# EAGLE design Main_Board_V2.0 (EAGLE 9.6.2)
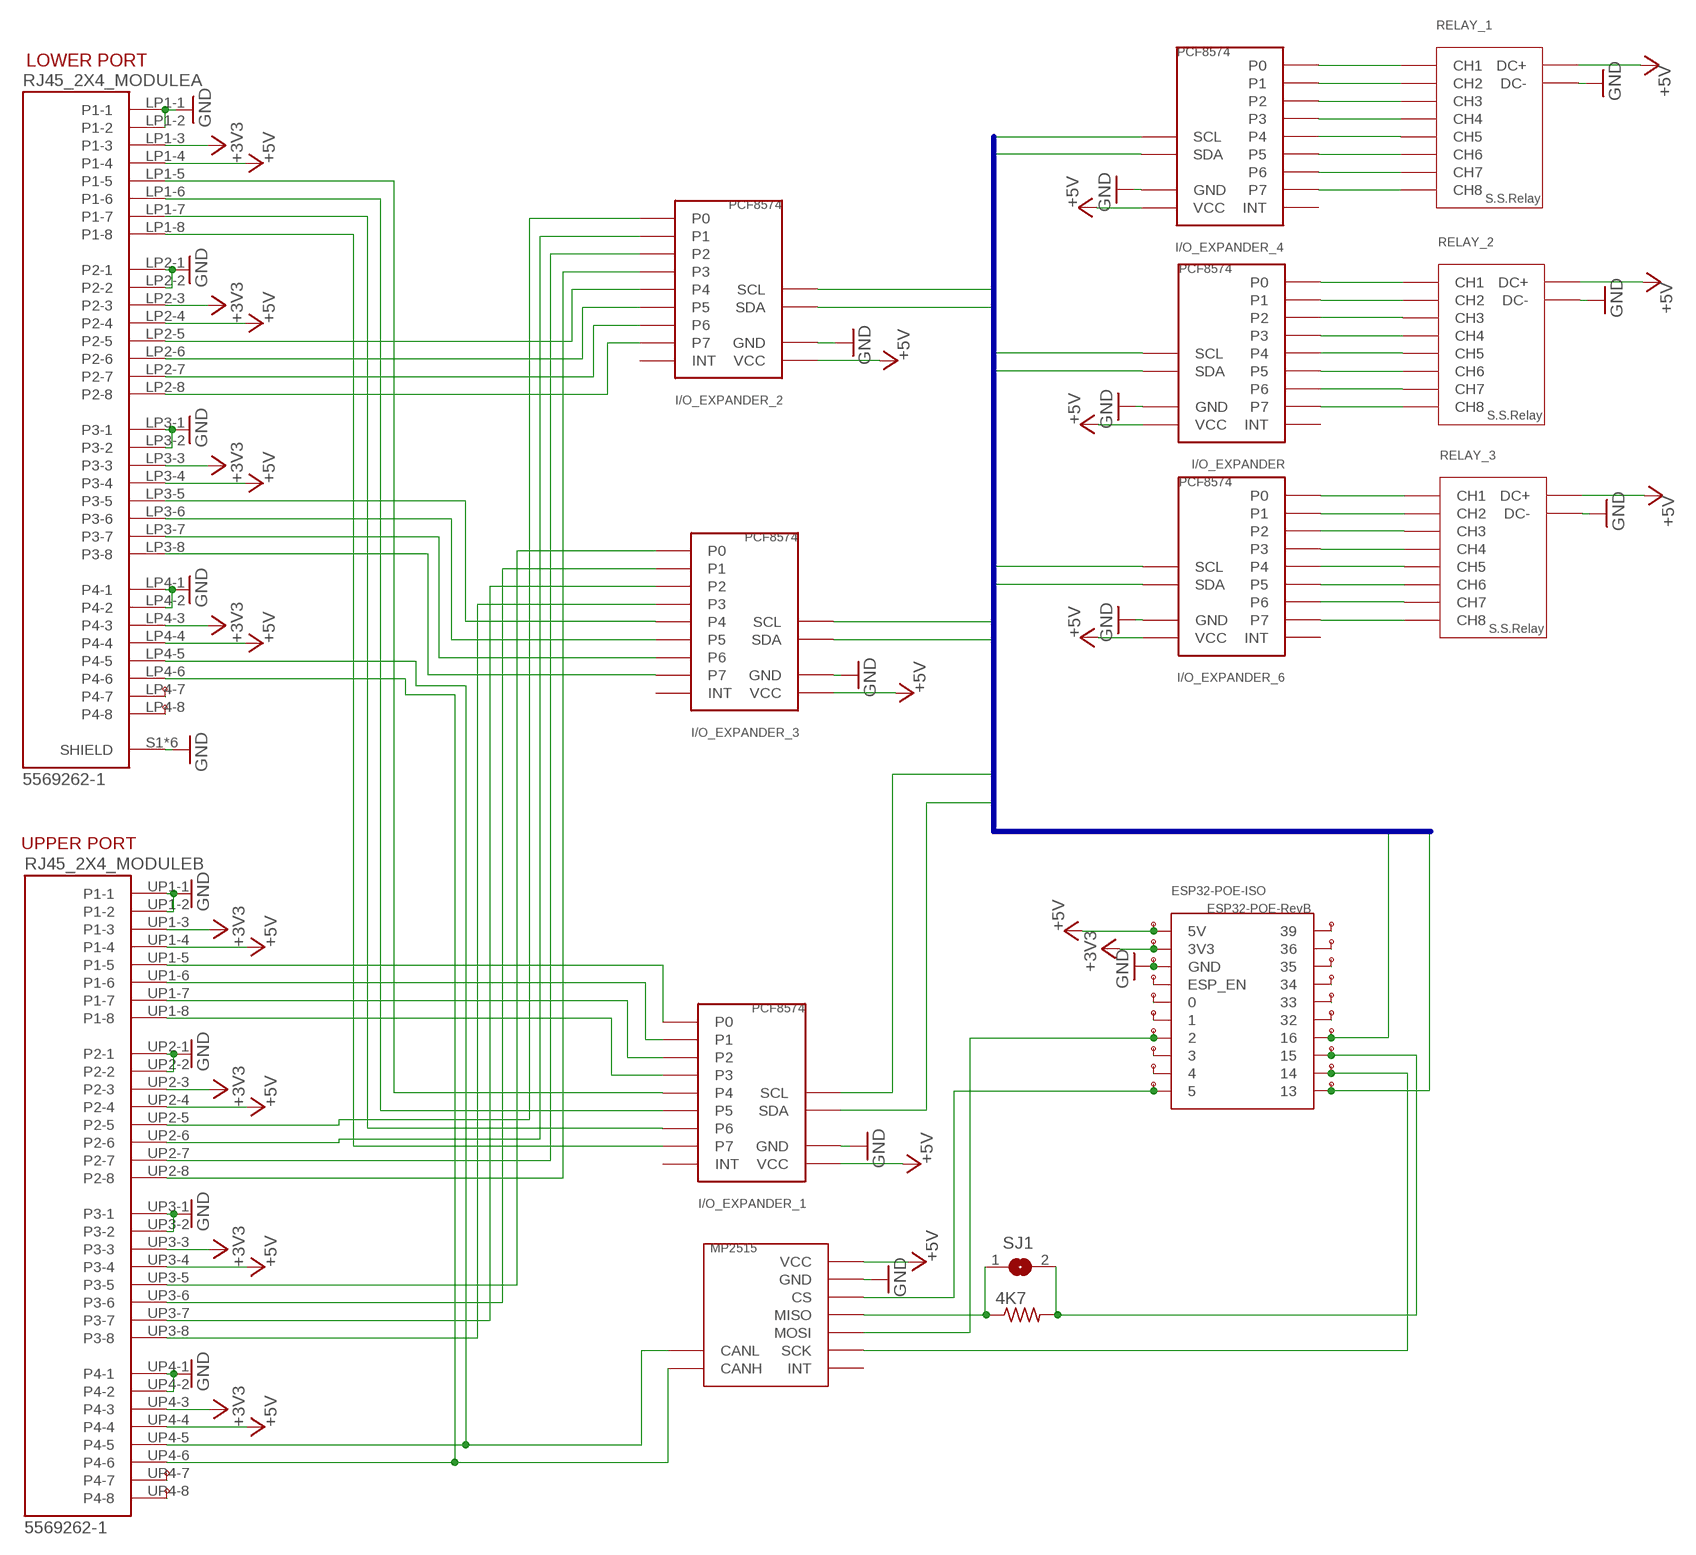
[diagram p0: schematic, sheet 1]

## Parts
4K7  R-US_0207/10  [0207/10]
ESP32-POE-ISO  ESP-POE  [ESP-POE]
I/O_EXPANDER  PCF8574-MODULE_ESPELHADO  [PCF8574-MODULE_ESPELHADO]
I/O_EXPANDER_1  PCF8574-MODULE_ESPELHADO  [PCF8574-MODULE_ESPELHADO]
I/O_EXPANDER_2  PCF8574-MODULE_ESPELHADO  [PCF8574-MODULE_ESPELHADO]
I/O_EXPANDER_3  PCF8574-MODULE_ESPELHADO  [PCF8574-MODULE_ESPELHADO]
I/O_EXPANDER_4  PCF8574-MODULE_ESPELHADO  [PCF8574-MODULE_ESPELHADO]
I/O_EXPANDER_6  PCF8574-MODULE_ESPELHADO  [PCF8574-MODULE_ESPELHADO]
RELAY_1  SSR_M_FULL_SEM_LIGACOES  [SSR_M_SEM_LIGACOES]
RELAY_2  SSR_M_FULL_SEM_LIGACOES  [SSR_M_SEM_LIGACOES]
RELAY_3  SSR_M_FULL_SEM_LIGACOES  [SSR_M_SEM_LIGACOES]
RJ45_2X4_MODULE  5569262-1  [TE_5569262-1]
SJ1  SJ  [SJ]
U$1  TP  [TP]
U$2  TP  [TP]
U$4  TP  [TP]
U$5  TP  [TP]
U$6  TP  [TP]
U$7  TP  [TP]
U$8  TP  [TP]
U$9  TP  [TP]
U$10  TP  [TP]
U$11  TP  [TP]
U$12  TP  [TP]
U$13  TP  [TP]
U$14  TP  [TP]
U$15  TP  [TP]
U$16  TP  [TP]
U$17  TP  [TP]
U$18  TP  [TP]
U$19  TP  [TP]
U$20  TP  [TP]
U$21  TP  [TP]
U$22  TP  [TP]
U$23  TP  [TP]
U$24  TP  [TP]
U$25  TP  [TP]
U$26  MCP2515_MODULE_SEM_LIGACOES  [MCP2515_MODULE_SEM_LIGACOES]

## Nets
+3V3 [+3.3V]: ESP32-POE-ISO.3V3 RJ45_2X4_MODULE.LP1-3(A:P1-3) RJ45_2X4_MODULE.LP2-3(A:P2-3) RJ45_2X4_MODULE.LP3-3(A:P3-3) RJ45_2X4_MODULE.LP4-3(A:P4-3) RJ45_2X4_MODULE.UP1-3(B:P1-3) RJ45_2X4_MODULE.UP2-3(B:P2-3) RJ45_2X4_MODULE.UP3-3(B:P3-3) RJ45_2X4_MODULE.UP4-3(B:P4-3) U$6.P$1
+5V [+5V]: ESP32-POE-ISO.5V I/O_EXPANDER.VCC I/O_EXPANDER_1.VCC I/O_EXPANDER_2.VCC I/O_EXPANDER_3.VCC I/O_EXPANDER_4.VCC I/O_EXPANDER_6.VCC RELAY_1.DC+ RELAY_2.DC+ RELAY_3.DC+ RJ45_2X4_MODULE.LP1-4(A:P1-4) RJ45_2X4_MODULE.LP2-4(A:P2-4) RJ45_2X4_MODULE.LP3-4(A:P3-4) RJ45_2X4_MODULE.LP4-4(A:P4-4) RJ45_2X4_MODULE.UP1-4(B:P1-4) RJ45_2X4_MODULE.UP2-4(B:P2-4) RJ45_2X4_MODULE.UP3-4(B:P3-4) RJ45_2X4_MODULE.UP4-4(B:P4-4) U$2.P$1 U$26.VCC
GND [GND]: ESP32-POE-ISO.GND I/O_EXPANDER.GND I/O_EXPANDER_1.GND I/O_EXPANDER_2.GND I/O_EXPANDER_3.GND I/O_EXPANDER_4.GND I/O_EXPANDER_6.GND RELAY_1.DC- RELAY_2.DC- RELAY_3.DC- RJ45_2X4_MODULE.LP1-1(A:P1-1) RJ45_2X4_MODULE.LP1-2(A:P1-2) RJ45_2X4_MODULE.LP2-1(A:P2-1) RJ45_2X4_MODULE.LP2-2(A:P2-2) RJ45_2X4_MODULE.LP3-1(A:P3-1) RJ45_2X4_MODULE.LP3-2(A:P3-2) RJ45_2X4_MODULE.LP4-1(A:P4-1) RJ45_2X4_MODULE.LP4-2(A:P4-2) RJ45_2X4_MODULE.S1(A:SHIELD) RJ45_2X4_MODULE.S2(A:SHIELD) RJ45_2X4_MODULE.S3(A:SHIELD) RJ45_2X4_MODULE.S4(A:SHIELD) RJ45_2X4_MODULE.S5(A:SHIELD) RJ45_2X4_MODULE.S6(A:SHIELD) RJ45_2X4_MODULE.UP1-1(B:P1-1) RJ45_2X4_MODULE.UP1-2(B:P1-2) RJ45_2X4_MODULE.UP2-1(B:P2-1) RJ45_2X4_MODULE.UP2-2(B:P2-2) RJ45_2X4_MODULE.UP3-1(B:P3-1) RJ45_2X4_MODULE.UP3-2(B:P3-2) RJ45_2X4_MODULE.UP4-1(B:P4-1) RJ45_2X4_MODULE.UP4-2(B:P4-2) U$7.P$1 U$26.GND
N$1: I/O_EXPANDER_1.P0 RJ45_2X4_MODULE.UP1-5(B:P1-5)
N$2: I/O_EXPANDER_1.P1 RJ45_2X4_MODULE.UP1-6(B:P1-6)
N$3: I/O_EXPANDER_1.P2 RJ45_2X4_MODULE.UP1-7(B:P1-7)
N$4: ESP32-POE-ISO.ESP_EN U$8.P$1
N$5: ESP32-POE-ISO.0 U$9.P$1
N$6: ESP32-POE-ISO.1 U$10.P$1
N$7: ESP32-POE-ISO.2 U$11.P$1 U$26.MOSI
N$8: ESP32-POE-ISO.3 U$12.P$1
N$9: ESP32-POE-ISO.4 U$13.P$1
N$10: ESP32-POE-ISO.5 U$14.P$1 U$26.CS
N$11: ESP32-POE-ISO.39 U$15.P$1
N$12: ESP32-POE-ISO.36 U$16.P$1
N$13: ESP32-POE-ISO.35 U$17.P$1
N$14: ESP32-POE-ISO.34 U$18.P$1
N$15: ESP32-POE-ISO.33 U$19.P$1
N$16: ESP32-POE-ISO.32 U$20.P$1
N$17: I/O_EXPANDER_1.P3 RJ45_2X4_MODULE.UP1-8(B:P1-8)
N$18: 4K7.2 ESP32-POE-ISO.15 SJ1.2 U$22.P$1
N$19: ESP32-POE-ISO.14 U$23.P$1 U$26.SCK
N$20: I/O_EXPANDER_2.P0 RJ45_2X4_MODULE.UP2-5(B:P2-5)
N$21: I/O_EXPANDER_4.P0 RELAY_1.CH1
N$22: I/O_EXPANDER_4.P1 RELAY_1.CH2
N$23: I/O_EXPANDER_4.P2 RELAY_1.CH3
N$24: I/O_EXPANDER_4.P3 RELAY_1.CH4
N$25: I/O_EXPANDER_4.P4 RELAY_1.CH5
N$26: I/O_EXPANDER_2.P1 RJ45_2X4_MODULE.UP2-6(B:P2-6)
N$27: I/O_EXPANDER_4.P5 RELAY_1.CH6
N$28: I/O_EXPANDER_4.P6 RELAY_1.CH7
N$29: I/O_EXPANDER_4.P7 RELAY_1.CH8
N$30: I/O_EXPANDER_6.P0 RELAY_3.CH1
N$31: I/O_EXPANDER_6.P1 RELAY_3.CH2
N$32: I/O_EXPANDER_6.P2 RELAY_3.CH3
N$33: I/O_EXPANDER_6.P3 RELAY_3.CH4
N$34: I/O_EXPANDER_6.P4 RELAY_3.CH5
N$35: I/O_EXPANDER_6.P5 RELAY_3.CH6
N$36: I/O_EXPANDER_6.P6 RELAY_3.CH7
N$37: I/O_EXPANDER_6.P7 RELAY_3.CH8
N$38: I/O_EXPANDER.P0 RELAY_2.CH1
N$39: I/O_EXPANDER.P1 RELAY_2.CH2
N$40: I/O_EXPANDER.P2 RELAY_2.CH3
N$41: I/O_EXPANDER.P3 RELAY_2.CH4
N$42: I/O_EXPANDER.P4 RELAY_2.CH5
N$43: I/O_EXPANDER.P5 RELAY_2.CH6
N$44: I/O_EXPANDER.P6 RELAY_2.CH7
N$45: I/O_EXPANDER.P7 RELAY_2.CH8
N$46: I/O_EXPANDER_1.P4 RJ45_2X4_MODULE.LP1-5(A:P1-5)
N$47: I/O_EXPANDER_1.P5 RJ45_2X4_MODULE.LP1-6(A:P1-6)
N$48: I/O_EXPANDER_1.P6 RJ45_2X4_MODULE.LP1-7(A:P1-7)
N$49: I/O_EXPANDER_1.P7 RJ45_2X4_MODULE.LP1-8(A:P1-8)
N$50: I/O_EXPANDER_2.P2 RJ45_2X4_MODULE.UP2-7(B:P2-7)
N$51: I/O_EXPANDER_2.P3 RJ45_2X4_MODULE.UP2-8(B:P2-8)
N$52: I/O_EXPANDER_2.P4 RJ45_2X4_MODULE.LP2-5(A:P2-5)
N$53: I/O_EXPANDER_2.P5 RJ45_2X4_MODULE.LP2-6(A:P2-6)
N$54: I/O_EXPANDER_2.P6 RJ45_2X4_MODULE.LP2-7(A:P2-7)
N$55: I/O_EXPANDER_2.P7 RJ45_2X4_MODULE.LP2-8(A:P2-8)
N$56: 4K7.1 SJ1.1 U$26.MISO
N$57: I/O_EXPANDER_3.P0 RJ45_2X4_MODULE.UP3-5(B:P3-5)
N$58 [SCL]: RJ45_2X4_MODULE.LP4-5(A:P4-5) RJ45_2X4_MODULE.UP4-5(B:P4-5) U$26.CL(CANL)
N$59: I/O_EXPANDER_3.P1 RJ45_2X4_MODULE.UP3-6(B:P3-6)
N$60: I/O_EXPANDER_3.P2 RJ45_2X4_MODULE.UP3-7(B:P3-7)
N$61: I/O_EXPANDER_3.P3 RJ45_2X4_MODULE.UP3-8(B:P3-8)
N$62: I/O_EXPANDER_3.P4 RJ45_2X4_MODULE.LP3-5(A:P3-5)
N$63: I/O_EXPANDER_3.P5 RJ45_2X4_MODULE.LP3-6(A:P3-6)
N$64: I/O_EXPANDER_3.P6 RJ45_2X4_MODULE.LP3-7(A:P3-7)
N$65: I/O_EXPANDER_3.P7 RJ45_2X4_MODULE.LP3-8(A:P3-8)
N$69: RJ45_2X4_MODULE.UP4-7(B:P4-7) U$1.P$1
N$70: RJ45_2X4_MODULE.UP4-8(B:P4-8) U$4.P$1
N$71: RJ45_2X4_MODULE.LP4-7(A:P4-7) U$5.P$1
N$72: RJ45_2X4_MODULE.LP4-8(A:P4-8) U$25.P$1
N$73 [SCL]: RJ45_2X4_MODULE.LP4-6(A:P4-6) RJ45_2X4_MODULE.UP4-6(B:P4-6) U$26.CH(CANH)
SCL: ESP32-POE-ISO.16 I/O_EXPANDER.SCL I/O_EXPANDER_1.SCL I/O_EXPANDER_2.SCL I/O_EXPANDER_3.SCL I/O_EXPANDER_4.SCL I/O_EXPANDER_6.SCL U$21.P$1
SDA: ESP32-POE-ISO.13 I/O_EXPANDER.SDA I/O_EXPANDER_1.SDA I/O_EXPANDER_2.SDA I/O_EXPANDER_3.SDA I/O_EXPANDER_4.SDA I/O_EXPANDER_6.SDA U$24.P$1
Unconnected: I/O_EXPANDER.INT I/O_EXPANDER_1.INT I/O_EXPANDER_2.INT I/O_EXPANDER_3.INT I/O_EXPANDER_4.INT I/O_EXPANDER_6.INT U$26.INT

## Buses
I2C:SCL,SDA

## Library data of the parts
4K7 = rcl:R-US_: RESISTOR, American symbol; SPICEPREFIX: R
ESP32-POE-ISO = ESP-POE-RevB:ESP-POE
I/O_EXPANDER I/O_EXPANDER_1-I/O_EXPANDER_4 I/O_EXPANDER_6 = PCF8574_Module:PCF8574-MODULE_ESPELHADO
RELAY_1-RELAY_3 = Solid-State-Relay_Module:SSR_M_FULL_SEM_LIGACOES
RJ45_2X4_MODULE = RJ45_2x4:5569262-1: Conn RJ-45 F 64 POS 2.54mm Solder RA Thru-Hole 64 Terminal 8 Port Cat 5 Check prices <https://pricing.snapeda.com/parts/5569262-1/TE%20Connectivity/view-part?ref=eda>; AVAILABILITY: Good; CENTERLINE_PITCH: 1.02 mm[.04 in]; COMMENT: 5569262-1; DESCRIPTION: Conn RJ-45 F 64 POS 2.54mm Solder RA Thru-Hole 64 Terminal 8 Port Cat 5 Tray; EU_ROHS_COMPLIANCE: Compliant; MF: TE Connectivity; MP: 5569262-1; NUMBER_OF_POSITIONS: 8; PACKAGE: None; PRICE: None; PURCHASE-URL: https://pricing.snapeda.com/search/part/5569262-1/?ref=eda
SJ1 = jumper:SJ: SMD solder JUMPER
U$1 U$2 U$4-U$25 = edurobotParts:TP
U$26 = MCP2515_Module:MCP2515_MODULE_SEM_LIGACOES

## Net classes
0 default: width 0.15 mm
1 +5V: width 0.305 mm
2 GND: width 0.305 mm
3 +3.3V: width 0.305 mm
4 SCL: width 0.15 mm
5 SDA: width 0.15 mm

## Board
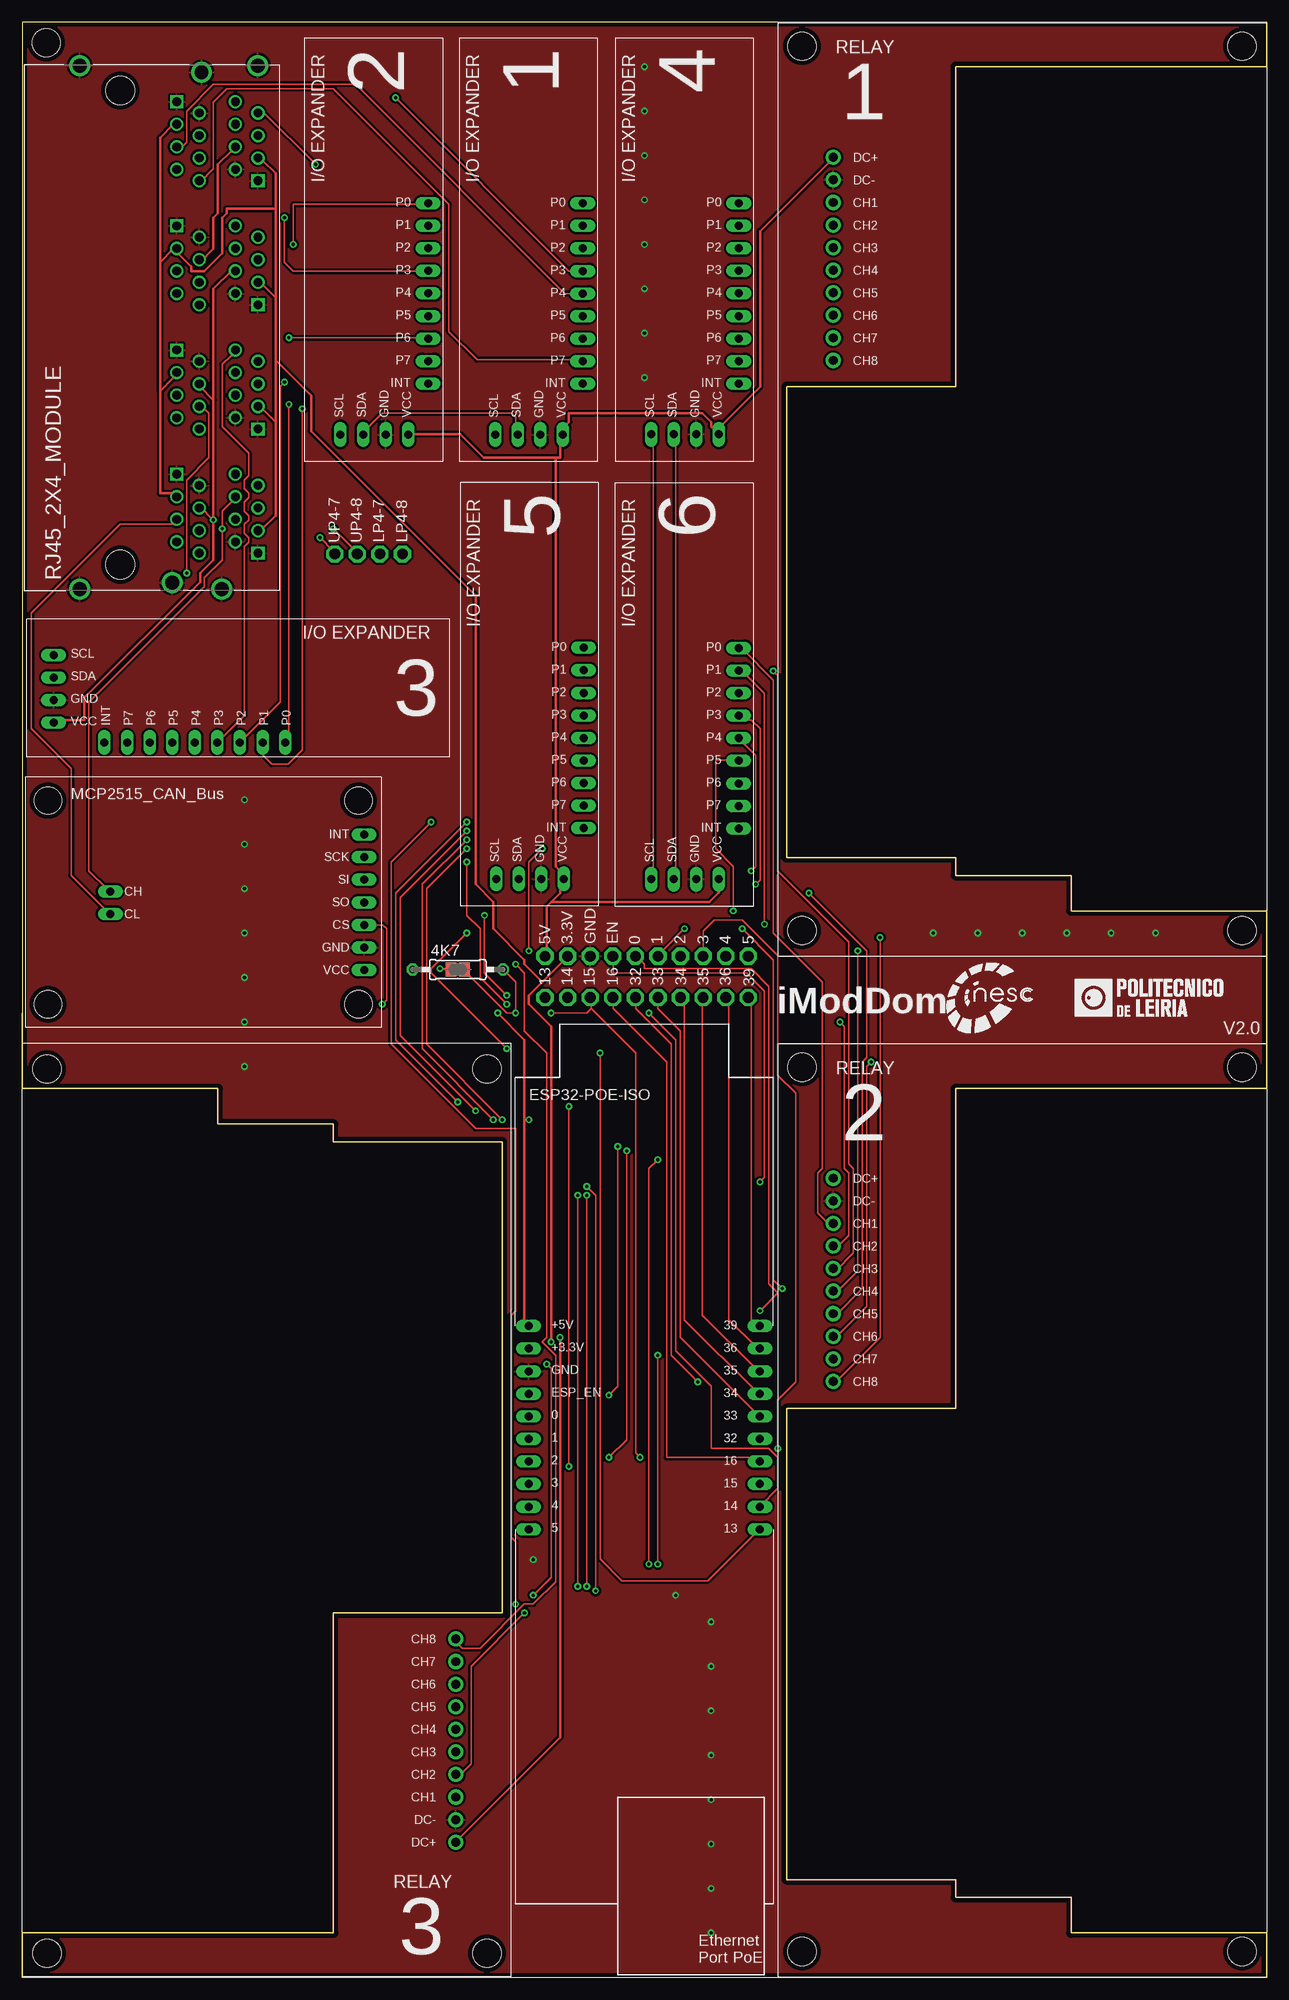
[diagram p1: board, top side]
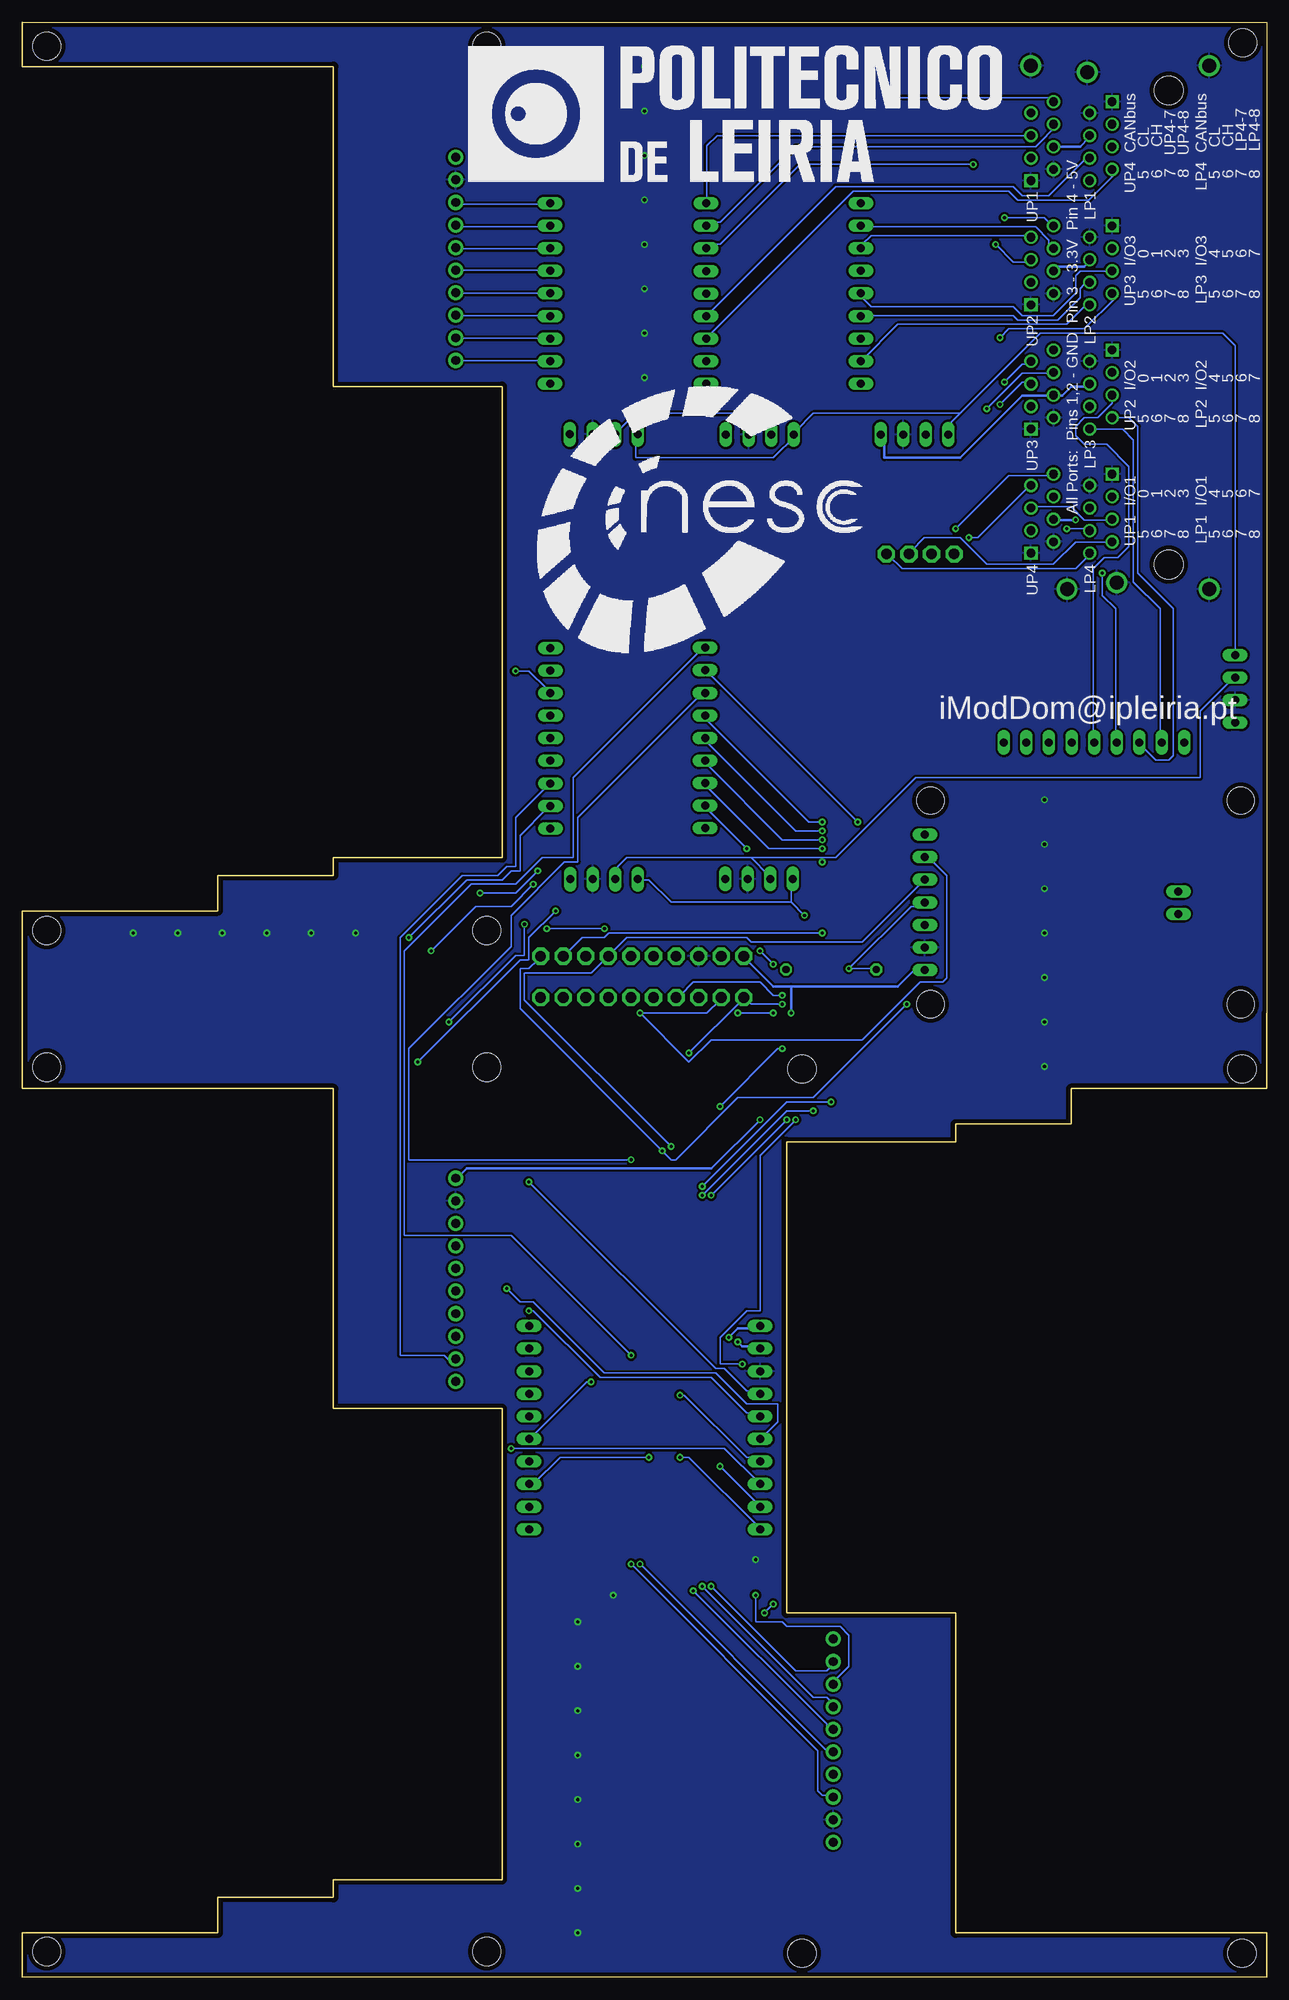
[diagram p2: board, bottom side, seen from below]

Size 140 x 220 mm. Coordinates in mm from the lower left corner, seen from the top.
Outline: 0,0 140,0 140,5 118,5 118,9 105,9 105,11 86,11 86,64 105,64 105,100 140,100 140,120 118,120 118,124 105,124 105,126 86,126 86,179 105,179 105,215 140,215 140,220 0,220 0,108.5 0,100 22,100 22,96 35,96 35,94 54,94 54,41 35,41 35,5 0,5 0,0
Copper layers (1*16): Top 0.035mm / dielectric 1.5mm / Bottom 0.035mm
Design rules "default *": minimum track width 6mil, minimum drill 0.35mm, track to track 0.25mm, track to pad 0.25mm, pad to pad 6mil, via to via 6mil, smd to smd 6mil, copper to edge 0.5mm, drill to drill 6mil, minimum pad ring 10mil, minimum via ring 8mil, stop-mask expansion 4mil, vias tented up to drill 0mil, thermal gap 10mil
Holes 3.2 mm at 2.7,217.7

### Footprints (pad centres in the part's own frame; a part is rotated, then mirrored left to right if it is on the bottom)
0207/10 = drill 0.813 octagon: 1 -5.08,0; 2 5.08,0
ESP-POE = drill 0.9 pad 1.3 long: 0 0,-10.16; 1 0,-12.7; 2 0,-15.24; 3 0,-17.78; 3V3 0,-2.54; 4 0,-20.32; 5 0,-22.86; 5V 0,0; 13 26,-22.86; 14 26,-20.32; 15 26,-17.78; 16 26,-15.24; 32 26,-12.7; 33 26,-10.16; 34 26,-7.62; 35 26,-5.08; 36 26,-2.54; 39 26,0; ESP_EN 0,-7.62; GND 0,-5.08
PCF8574-MODULE_ESPELHADO = drill 0.9 pad 1.3 long: GND 0,-5.08; INT 5.71,-9.85; P0 26.03,-9.85; P1 23.49,-9.85; P2 20.95,-9.85; P3 18.41,-9.85; P4 15.87,-9.85; P5 13.33,-9.85; P6 10.79,-9.85; P7 8.25,-9.85; SCL 0,0; SDA 0,-2.54; VCC 0,-7.62
SSR_M_SEM_LIGACOES = drill 1 pad 1.7: CH1 17.58,3.5; CH2 20.12,3.5; CH3 22.66,3.5; CH4 25.2,3.5; CH5 27.74,3.5; CH6 30.28,3.5; CH7 32.82,3.5; CH8 35.36,3.5; DC+ 12.5,3.5; DC- 15.04,3.5 | hole 3.2: 0,0; 99.5,0; 99.5,49.5; 0,49.5
TE_5569262-1 = drill 0.97 square: LP1-1 0,0; LP2-1 13.97,0; LP3-1 27.94,0; LP4-1 41.91,0; UP1-1 8.89,9.14; UP2-1 22.86,9.14; UP3-1 36.83,9.14; UP4-1 50.8,9.14 | drill 0.97: LP1-2 1.27,2.54; LP1-3 2.54,0; LP1-4 3.81,2.54; LP1-5 5.08,0; LP1-6 6.35,2.54; LP1-7 7.62,0; LP1-8 8.89,2.54; LP2-2 15.24,2.54; LP2-3 16.51,0; LP2-4 17.78,2.54; LP2-5 19.05,0; LP2-6 20.32,2.54; LP2-7 21.59,0; LP2-8 22.86,2.54; LP3-2 29.21,2.54; LP3-3 30.48,0; LP3-4 31.75,2.54; LP3-5 33.02,0; LP3-6 34.29,2.54; LP3-7 35.56,0; LP3-8 36.83,2.54; LP4-2 43.18,2.54; LP4-3 44.45,0; LP4-4 45.72,2.54; LP4-5 46.99,0; LP4-6 48.26,2.54; LP4-7 49.53,0; LP4-8 50.8,2.54; UP1-2 7.62,6.6; UP1-3 6.35,9.14; UP1-4 5.08,6.6; UP1-5 3.81,9.14; UP1-6 2.54,6.6; UP1-7 1.27,9.14; UP1-8 0,6.6; UP2-2 21.59,6.6; UP2-3 20.32,9.14; UP2-4 19.05,6.6; UP2-5 17.78,9.14; UP2-6 16.51,6.6; UP2-7 15.24,9.14; UP2-8 13.97,6.6; UP3-2 35.56,6.6; UP3-3 34.29,9.14; UP3-4 33.02,6.6; UP3-5 31.75,9.14; UP3-6 30.48,6.6; UP3-7 29.21,9.14; UP3-8 27.94,6.6; UP4-2 49.53,6.6; UP4-3 48.26,9.14; UP4-4 46.99,6.6; UP4-5 45.72,9.14; UP4-6 44.45,6.6; UP4-7 43.18,9.14; UP4-8 41.91,6.6 | drill 1.57: S1 -4.06,-10.92; S2 54.87,-10.92; S3 -4.06,9.14; S4 54.11,-0.51; S5 -3.3,2.79; S6 54.87,5.08 | hole 3.25: -1.27,-6.35; 52.08,-6.35
SJ = smd 1.168 x 1.6: 1 -0.762,0; 2 0.762,0
TP = drill 1.2 pad 1.93 octagon: P$1 0,0
MCP2515_MODULE_SEM_LIGACOES = drill 0.9 pad 1.3 long: CH -27.925,12.703; CL -27.925,10.163; CS 0.605,8.923; GND 0.605,6.383; INT 0.605,19.083; MISO 0.605,11.463; MOSI 0.605,14.003; SCK 0.605,16.543; VCC 0.605,3.843 | hole 3.1: -0.035,0.013; -0.035,22.913; -34.935,22.913; -34.935,0.013

### Placement (x,y rotation side)
4K7  49,113.4 0 top
ESP32-POE-ISO  56.98,73.28 0 top
I/O_EXPANDER  53.32,123.59 90 top
I/O_EXPANDER_1  53.21,173.6 90 top
I/O_EXPANDER_2  35.81,173.62 90 top
I/O_EXPANDER_3  3.54,148.8 0 top
I/O_EXPANDER_4  70.76,173.62 90 top
I/O_EXPANDER_6  70.74,123.56 90 top
RELAY_1  87.74,217.3 270 top
RELAY_2  52.28,2.7 90 top
RELAY_3  87.74,102.41 270 top
RJ45_2X4_MODULE  17.38,211.06 270 top
SJ1  49,113.4 0 top
U$1  35.16,160.16 90 top
U$2  58.82,114.9 90 top
U$4  37.7,160.16 0 bottom
U$5  40.24,160.16 0 top
U$6  61.36,114.9 90 bottom
U$7  63.9,114.9 90 top
U$8  66.44,114.9 90 top
U$9  68.98,114.9 90 top
U$10  71.52,114.9 90 top
U$11  74.06,114.9 90 top
U$12  76.6,114.9 90 bottom
U$13  79.14,114.9 90 bottom
U$14  81.68,114.9 90 top
U$15  81.68,110.26 270 bottom
U$16  79.14,110.26 270 top
U$17  76.6,110.26 270 top
U$18  74.06,110.26 270 top
U$19  71.52,110.26 270 top
U$20  68.98,110.26 270 top
U$21  66.44,110.26 270 top
U$22  63.9,110.26 270 top
U$23  61.36,110.26 270 top
U$24  58.82,110.26 270 top
U$25  42.78,160.16 0 top
U$26  37.85,109.5 0 top

### Tracks (layer width: path | path; a pad name or v marks a point on that pad's centre or on a via)
+3V3  (via drill 0.35)
  Top 0.305: v59.5,71.5 59.5,107 57,109.5 57,110.5 58.5,112 | 58.5,112 61,114.5 U$6.P$1 | 28.5,175 28.5,164.5 27,163 RJ45_2X4_MODULE.UP4-3 | 28.5,175 27,176.5 RJ45_2X4_MODULE.UP3-3 | 28.5,189 27,190.5 RJ45_2X4_MODULE.UP2-3 | 28.5,175 28.5,182 | 28.5,182 28.5,189 | 28.5,189 28.5,199 | 28.5,199 28.5,203 27,204.5 RJ45_2X4_MODULE.UP1-3 | 15.5,178.5 15.5,167 17,167 RJ45_2X4_MODULE.LP4-3 | 15.5,178.5 17,180 17,180.5 RJ45_2X4_MODULE.LP3-3 | 15.5,193 17,194.5 RJ45_2X4_MODULE.LP2-3 17.5,194.5 17.5,194 19,192.5 19,192 20.5,192 22.5,194 22.5,198 23,198.5 23,199 28.5,199 | 15.5,178.5 15.5,193 | 15.5,193 15.5,207 17,208.5 RJ45_2X4_MODULE.LP1-3 | 58.5,112 56.5,114 56.5,114.5 53,118 53,121 51,123 51,155.5 32.5,174 32.5,178 28.5,182
  Bottom 0.305: v59.5,71.5 59,71 57,71 ESP32-POE-ISO.3V3
+5V  (via drill 0.35)
  Top 0.305: 60,171 60.5,171 60.5,173.5 I/O_EXPANDER_1.VCC 61,174 61,174.5 61.5,175 61.5,176 76.5,176 77.5,175 77.5,174.5 78,174 I/O_EXPANDER_4.VCC 78.5,174 78.5,174.5 83,179 83,196.5 91,204.5 RELAY_1.DC+ | 60,171 51.91,171 49.28,173.63 43.65,173.63 43.63,173.62 I/O_EXPANDER_2.VCC | v21.5,164 21.5,159.5 20,158 20,157 7,144 7,141.5 4,141.5 I/O_EXPANDER_3.VCC | v21.5,164 20,165.5 RJ45_2X4_MODULE.LP4-4 | 21.5,177.5 20,179 RJ45_2X4_MODULE.LP3-4 | v21.5,164 21.5,177.5 | 21.5,177.5 21.5,190 23.5,192 RJ45_2X4_MODULE.UP2-4 | RJ45_2X4_MODULE.UP1-4 23.5,205.5 22,204 22,198.5 21.5,198 21.5,194.5 20,193 RJ45_2X4_MODULE.LP2-4 | 56.5,96.5 56.5,105.5 v53.5,108.5 | 56.5,96.5 56.5,73.5 ESP32-POE-ISO.5V | 59.5,121 59,120.5 59,115 U$2.P$1 | 59.5,121 60.5,122 60.5,123.5 I/O_EXPANDER.VCC 60.5,124 60.5,124.5 60,125 60,171 | I/O_EXPANDER_6.VCC 78.36,122.09 77.27,121 59.5,121 | v60.5,72 60.5,27 49,15.5 RELAY_2.DC+ | 56.5,96.5 v57,96.5
  Bottom 0.305: RJ45_2X4_MODULE.LP1-4 20,207 21,206 23.5,206 RJ45_2X4_MODULE.UP1-4 | RJ45_2X4_MODULE.LP2-4 20,193 20.5,192.5 23.5,192.5 RJ45_2X4_MODULE.UP2-4 | RJ45_2X4_MODULE.LP3-4 20,179 22,179 23,178 23.5,178 RJ45_2X4_MODULE.UP3-4 24,178 27.5,178 34.5,171 43,171 43,173.5 I/O_EXPANDER_2.VCC | v21.5,164 23.5,164 RJ45_2X4_MODULE.UP4-4 | 53.5,111.5 55.5,111.5 58.5,114.5 U$2.P$1 | 53.5,111.5 41.5,111.5 39.7,113.3 38.46,113.3 38.45,113.32 U$26.VCC | 53.5,111.5 v53.5,108.5 | v60.5,72 59.5,73 57,73 ESP32-POE-ISO.5V | v57,96.5 62.5,91 90,91 91,90 RELAY_3.DC+
GND  (via drill 0.35)
  other vias: 73.5,43 57.5,47 70,180 70,185 70,190 70,195 70,200 70,205 70,210 70,215 25,132.5 25,127.5 25,122.5 25,117.5 25,112.5 25,107.5 25,102.5 102.5,117.5 107.5,117.5 112.5,117.5 117.5,117.5 122.5,117.5 127.5,117.5 77.5,40 77.5,35 77.5,30 77.5,25 77.5,20 77.5,15 77.5,10 77.5,5
  pour Top: -10,230 -10,-10 150,-10 150,230
  pour Bottom: -10,230 150,230 150,-10 -10,-10
N$1
  Bottom 0.152: I/O_EXPANDER_1.P0 63,200 63,206.08 61.83,207.25 RJ45_2X4_MODULE.UP1-5
N$2
  Bottom 0.152: I/O_EXPANDER_1.P1 63,197.5 61.5,197.5 53,206 26,206 23.5,208.5 RJ45_2X4_MODULE.UP1-6
N$3  (via drill 0.35)
  Top 0.152: v33,204 27,210 RJ45_2X4_MODULE.UP1-7
  Bottom 0.152: v33,204 52.5,204 61.5,195 63,195 I/O_EXPANDER_1.P2
N$4  (via drill 0.35)
  Top 0.152: v83,89.5 83.5,90 83.5,111 81.5,113 66.5,113 66.5,114.5 U$8.P$1
  Bottom 0.152: v83,89.5 62,68.5 61,68.5 58.5,66 57,66 ESP32-POE-ISO.ESP_EN
N$5  (via drill 0.35)
  Top 0.152: v83,75 85,77 84,78 84,111.5 82,113.5 70,113.5 70,114 69,115 U$9.P$1
  Bottom 0.152: v83,75 82.5,75 75,67.5 62.5,67.5 58.5,63.5 57,63.5 ESP32-POE-ISO.0
N$6  (via drill 0.35)
  Top 0.152: v85.5,77.5 84.5,78.5 84.5,114.5 v81,118 | v74.5,118 72,115.5 72,115 U$10.P$1
  Bottom 0.152: v85.5,77.5 84,76 82.5,76 74.5,68 62,68 58.5,64.5 55,64.5 55,62.5 56.5,61 ESP32-POE-ISO.1 | v74.5,118 v81,118
N$7  (via drill 0.35)
  Top 0.152: v66,65.5 67,66.5 v67,93.5
  Bottom 0.152: v66,65.5 65.5,65.5 58.5,58.5 57,58.5 ESP32-POE-ISO.2 | v67,93.5 83.5,110 83.5,113 76,113 74.5,114.5 U$11.P$1 74,115 72,117 58.5,117 58,116.5 45.5,116.5 38.5,123.5 U$26.MOSI
N$8  (via drill 0.35)
  Top 0.152: v85,59.5 85,65 87,67 87,99.5 85,101.5 85,115 81,119 77.86,119 76.6,117.74 U$12.P$1
  Bottom 0.152: v85,59.5 61,59.5 57,55.5 ESP32-POE-ISO.3
N$9  (via drill 0.35)
  Top 0.152: v61.5,98 v61.5,57.5 | v54.5,104.5 46,113 46,113.5 v50,117.5
  Bottom 0.152: v61.5,57.5 57,53 ESP32-POE-ISO.4 | v61.5,98 55,104.5 v54.5,104.5 | v50,117.5 74,117.5 74.5,117 77,117 79,115 U$13.P$1
N$10  (via drill 0.35)
  Top 0.152: v66,58.5 68,60.5 v68,93 | v40.5,109.5 41,110 41,118 40.58,118.42 U$26.CS
  Bottom 0.152: v66,58.5 65,58.5 57,50.5 ESP32-POE-ISO.5 | U$14.P$1 82,114.5 83,113.5 84,113.5 84,109 v68,93 67,92 66.5,92 59.5,99 51,99 v40.5,109.5
N$11
  Top 0.152: ESP32-POE-ISO.39 82.5,73.5 82,74 82,110 U$15.P$1
N$12
  Top 0.152: ESP32-POE-ISO.36 82.5,71 79.5,74 79.5,110 U$16.P$1
N$13
  Top 0.152: ESP32-POE-ISO.35 82.5,68.5 76.5,74.5 76.5,110 U$17.P$1
N$14
  Top 0.152: ESP32-POE-ISO.34 82.5,66 74.5,74 74.5,110 U$18.P$1
N$15
  Top 0.152: ESP32-POE-ISO.33 82.5,63.5 74,72 74,106.5 71.5,109 71.5,110 U$19.P$1
N$16  (via drill 0.35)
  Top 0.152: v76,67 73,70 73,105 69,109 69,110 U$20.P$1
  Bottom 0.152: v76,67 76.5,67 82.5,61 ESP32-POE-ISO.32
N$17  (via drill 0.35)
  Top 0.152: I/O_EXPANDER_1.P3 61.49,192.01 v42,211.5
  Bottom 0.152: v42,211.5 24,211.5 RJ45_2X4_MODULE.UP1-8
N$18  (via drill 0.35)
  Top 0.152: SJ1.2 50,113 54.5,108.5 v55.5,108.5 55.5,112 54.5,113 4K7.2 | v69.5,58.5 69,59 69,104 64,109 | 64,109 64,110 U$22.P$1 | v59.5,108.5 63.5,108.5 64,109
  Bottom 0.152: v69.5,58.5 79.5,58.5 82.5,55.5 ESP32-POE-ISO.15 | v59.5,108.5 v55.5,108.5
N$19  (via drill 0.35)
  Top 0.152: v70.5,108.5 73.5,105.5 73.5,70.5 77.5,66.5 77.5,59.5 84,59.5 85,58.5 85,55 83,53 ESP32-POE-ISO.14
  Bottom 0.152: U$23.P$1 61.5,110 63,108.5 v70.5,108.5 65,103 62.5,105.5 45.5,105.5 39,112 36.45,112 36,112.45 36,124 38,126 U$26.SCK
N$20  (via drill 0.35)
  Top 0.152: v30.5,195 30.5,199.5 45.5,199.5 I/O_EXPANDER_2.P0
  Bottom 0.152: v30.5,195 28.5,193 27,193 RJ45_2X4_MODULE.UP2-5
N$21
  Bottom 0.152: I/O_EXPANDER_4.P0 81,199.5 91,199.5 RELAY_1.CH1
N$22
  Bottom 0.152: I/O_EXPANDER_4.P1 81,197 91,197 RELAY_1.CH2
N$23
  Bottom 0.152: I/O_EXPANDER_4.P2 81,194.5 91,194.5 RELAY_1.CH3
N$24
  Bottom 0.152: I/O_EXPANDER_4.P3 80.69,192.11 91.22,192.11 RELAY_1.CH4
N$25
  Bottom 0.152: I/O_EXPANDER_4.P4 91.48,189.48 91.5,189.5 RELAY_1.CH5
N$26
  Bottom 0.152: I/O_EXPANDER_2.P1 45.5,197 26,197 24.5,195.5 24.5,194.5 24,194.5 RJ45_2X4_MODULE.UP2-6
N$27
  Bottom 0.152: I/O_EXPANDER_4.P5 81,187 91,187 RELAY_1.CH6
N$28
  Bottom 0.152: RELAY_1.CH7 91.19,184.43 80.68,184.43 I/O_EXPANDER_4.P6
N$29
  Bottom 0.152: I/O_EXPANDER_4.P7 80.83,181.94 91.25,181.94 RELAY_1.CH8
N$30
  Top 0.152: I/O_EXPANDER_6.P0 81,149.5 84.5,146 84.5,117.5 90,112 90,91 89.5,90.5 89.5,86 91,84.5 RELAY_3.CH1
N$31  (via drill 0.35)
  Top 0.152: v83.5,118.5 83.5,144.5 81,147 I/O_EXPANDER_6.P1 | v92,107.5 92.5,107 92.5,91 93,90.5 93,83.5 91.5,82 RELAY_3.CH2
  Bottom 0.152: v83.5,118.5 83.5,115 84.5,115 v92,107.5
N$32  (via drill 0.35)
  Top 0.152: v84.5,147 85,146.5 85,124.5 93,116.5 93,91.5 93.5,91 93.5,81.5 91.5,79.5 RELAY_3.CH3
  Bottom 0.152: v84.5,147 83,147 81,145 I/O_EXPANDER_6.P2
N$33  (via drill 0.35)
  Top 0.152: v82.5,123 83,123.5 83,140.5 82,141.5 81,141.5 I/O_EXPANDER_6.P3 | v94,115.5 94,79.5 91.5,77 RELAY_3.CH4
  Bottom 0.152: v82.5,123 85,120.5 89,120.5 v94,115.5
N$34  (via drill 0.35)
  Top 0.152: v82,124.5 82.5,125 82.5,137.5 81,139 I/O_EXPANDER_6.P4 | v88.5,122 95,115.5 95,103.5 94.5,103 94.5,77.5 91.5,74.5 RELAY_3.CH5
  Bottom 0.152: v82,124.5 84.5,122 v88.5,122
N$35  (via drill 0.35)
  Top 0.152: v80,120 80,125 78,127 78,137 80.5,137 I/O_EXPANDER_6.P5 | v95.5,103 95,102.5 95,75.5 91.5,72 RELAY_3.CH6
  Bottom 0.152: v80,120 83,117 83,114.5 84,114.5 v95.5,103
N$36
  Bottom 0.152: I/O_EXPANDER_6.P6 81,134 84.5,130.5 84.5,125 85.5,125 86.5,124 90.5,124 97.5,117 97.5,70 92.5,70 92,69.5 91.5,69.5 RELAY_3.CH7
N$37  (via drill 0.35)
  Top 0.152: v96.5,117 96.5,72 91.5,67 RELAY_3.CH8
  Bottom 0.152: v96.5,117 90,123.5 86,123.5 85,124.5 84,124.5 84,128.5 81,131.5 I/O_EXPANDER_6.P7
N$38  (via drill 0.35)
  Top 0.152: v71.5,46.5 v71.5,70
  Bottom 0.152: v71.5,70 85,83.5 97,83.5 97,115.5 89.5,123 84.5,123 81.5,126 78,126 78,135 63.5,149.5 I/O_EXPANDER.P0 | v71.5,46.5 50.5,25.5 50.5,21 50,20.5 49,20.5 RELAY_2.CH1
N$39  (via drill 0.35)
  Top 0.152: v46,130 41.5,125.5 41.5,105 51,95.5 55.5,95.5 55.5,75 55,74.5 55,49.5 55.5,49 v55.5,42 | v56.5,41 50.5,35 50.5,24 49,22.5 RELAY_2.CH2
  Bottom 0.152: v46,130 63,147 I/O_EXPANDER.P1 | v56.5,41 v55.5,42
N$40  (via drill 0.35)
  Top 0.152: v71.5,92 70.5,91 v70.5,46.5
  Bottom 0.152: v71.5,92 96.5,92 96.5,104.5 85,116 85,119.5 79,125.5 77.5,125.5 77.5,130.5 63.5,144.5 I/O_EXPANDER.P2 | v70.5,46.5 49.5,25.5 49,25.5 RELAY_2.CH3
N$41  (via drill 0.35)
  Top 0.152: v50,130 42,122 42,105.5 v49,98.5 | v63.5,89 64.5,88 v64.5,43.5
  Bottom 0.152: v50,130 51.5,130 63,141.5 I/O_EXPANDER.P3 | v49,98.5 54,98.5 v63.5,89 | v64.5,43.5 49.5,28.5 49.5,28 49,28 RELAY_2.CH4
N$42  (via drill 0.35)
  Top 0.152: v50,129 42.5,121.5 42.5,106 v51,97.5 | v63.5,44 v63.5,88
  Bottom 0.152: v50,129 53,129 63,139 I/O_EXPANDER.P4 | v51,97.5 54,97.5 v63.5,88 | v63.5,44 51,31.5 49.5,31.5 48.5,30.5 RELAY_2.CH5
N$43  (via drill 0.35)
  Top 0.152: v50,128 45,123 45,104.5 v53,96.5 | v59,69 59.5,68.5 59.5,45 v57.5,43
  Bottom 0.152: v50,128 54.5,128 63,136.5 I/O_EXPANDER.P5 | v53,96.5 57,92.5 57,75 58.5,75 61.5,72 61.5,69 v59,69 | v57.5,43 57.5,40 54.5,40 54,39.5 48,39.5 47,38.5 47,35 49,33 RELAY_2.CH6
N$44  (via drill 0.35)
  Top 0.152: v50,127 45.5,122.5 45.5,105 v54,96.5 | v62.5,44 v62.5,88
  Bottom 0.152: v50,127 56,127 63,134 I/O_EXPANDER.P6 | v62.5,88 v54,96.5 | v62.5,44 53,34.5 49.5,34.5 48.5,35.5 RELAY_2.CH7
N$45  (via drill 0.35)
  Top 0.152: v58.5,127 57,125.5 v57,115.5 | v55.5,114 56.5,113 56.5,106.5 59,104 59,72 58.5,71.5 60,70 60,44.5 57.5,42 56.5,42 51.5,37 49.5,37 49,37.5 49,38 RELAY_2.CH8
  Bottom 0.152: v58.5,127 63,131.5 I/O_EXPANDER.P7 | v55.5,114 v57,115.5
N$46
  Top 0.152: RJ45_2X4_MODULE.LP1-5 17.5,205.5 18.5,206.5 18.5,210 21.5,213 37.5,213 61.03,189.47 I/O_EXPANDER_1.P4
N$47
  Bottom 0.152: I/O_EXPANDER_1.P5 63,187 48.5,201.5 28.5,201.5 27.5,200.5 24.5,200.5 20.5,204.5 20,204.5 RJ45_2X4_MODULE.LP1-6
N$48
  Bottom 0.152: I/O_EXPANDER_1.P6 63,184.5 46.5,201 29,201 28,200 20,200 17,203 RJ45_2X4_MODULE.LP1-7
N$49
  Top 0.152: I/O_EXPANDER_1.P7 63,182 51.18,182 48,185.18 48,199.5 35,212.5 23,212.5 21.5,211 21.5,203.5 20,202 RJ45_2X4_MODULE.LP1-8
N$50
  Bottom 0.152: I/O_EXPANDER_2.P2 45.5,195 44.5,196 27,196 RJ45_2X4_MODULE.UP2-7
N$51  (via drill 0.35)
  Top 0.152: I/O_EXPANDER_2.P3 45.5,192 30.5,192 29.5,193 v29.5,198
  Bottom 0.152: v29.5,198 25,198 24.5,197.5 24,197.5 RJ45_2X4_MODULE.UP2-8
N$52
  Bottom 0.152: I/O_EXPANDER_2.P4 45.5,189 44.5,188 28.5,188 27.5,187 24,187 21.5,189.5 21.5,191.5 21,192 RJ45_2X4_MODULE.LP2-5
N$53
  Bottom 0.152: I/O_EXPANDER_2.P5 45.5,187 28.5,187 28,186.5 23.5,186.5 21,189 21,190 20.5,190.5 20,190.5 RJ45_2X4_MODULE.LP2-6
N$54  (via drill 0.35)
  Top 0.152: v30,184.5 45.5,184.5 I/O_EXPANDER_2.P6
  Bottom 0.152: v30,184.5 29,185.5 20.5,185.5 17,189 RJ45_2X4_MODULE.LP2-7
N$55
  Bottom 0.152: I/O_EXPANDER_2.P7 45.5,182 41.5,186 22.5,186 20.5,188 20,188 RJ45_2X4_MODULE.LP2-8
N$56  (via drill 0.35)
  Top 0.152: v47,113.5 48,113.5 SJ1.1
  Bottom 0.152: 4K7.1 44,113.5 v47,113.5 40,120.5 38.5,120.5 U$26.MISO
N$57  (via drill 0.35)
  Top 0.152: v30,177 30,139 I/O_EXPANDER_3.P0
  Bottom 0.152: v30,177 27.5,179.5 27,179.5 RJ45_2X4_MODULE.UP3-5
N$58
  Top 0.152: U$26.CL 9.5,120 5.5,124 5.5,136 1,140.5 1,153.5 11,163.5 17.5,163.5 17.5,164 RJ45_2X4_MODULE.LP4-5
  Bottom 0.152: RJ45_2X4_MODULE.UP4-5 26.5,165.5 22,165.5 20.5,164 17.5,164 RJ45_2X4_MODULE.LP4-5
N$59  (via drill 0.35)
  Top 0.152: I/O_EXPANDER_3.P1 27.03,137.53 28.06,136.5 29.91,136.5 31.49,138.08 31.5,138.07 v31.5,176.5
  Bottom 0.152: v31.5,176.5 27.5,180.5 24,180.5 RJ45_2X4_MODULE.UP3-6
N$60  (via drill 0.35)
  Top 0.152: v29.5,179.5 29,179 29,143.5 24.5,139 I/O_EXPANDER_3.P2
  Bottom 0.152: v29.5,179.5 27.5,181.5 27,181.5 RJ45_2X4_MODULE.UP3-7
N$61
  Top 0.152: I/O_EXPANDER_3.P3 22,139 25,142 25,161 25.5,161.5 25.5,162 25,162.5 25,163.5 25.5,164 25.5,164.5 25,165 25,166 25.5,166.5 25.5,167 25,167.5 25,168.5 25.5,169 25.5,171.5 22.5,174.5 22.5,181.5 23.5,182.5 24,182.5 24,183 RJ45_2X4_MODULE.UP3-8
N$62
  Bottom 0.152: I/O_EXPANDER_3.P4 19.5,139 19.5,158.5 18.25,159.75 16.75,159.75 15.5,161 15.5,170 18,172.5 20.5,172.5 21.5,173.5 21.5,174.5 20.5,175.5 19,175.5 17.38,177.12 RJ45_2X4_MODULE.LP3-5
N$63  (via drill 0.35)
  Top 0.152: v18.5,158 18.5,168.5 21,171 21,176 20,177 RJ45_2X4_MODULE.LP3-6
  Bottom 0.152: v18.5,158 18.5,155.5 17,154 17,139 I/O_EXPANDER_3.P5
N$64
  Bottom 0.152: I/O_EXPANDER_3.P6 14,138.5 12.5,137 11,137 10.5,137.5 10.5,154 14.5,158 14.5,174.5 15.49,175.5 RJ45_2X4_MODULE.LP3-7
N$65
  Bottom 0.152: I/O_EXPANDER_3.P7 12,139 12,154 15,157 15,173 16.21,174.21 19.89,174.21 RJ45_2X4_MODULE.LP3-8
N$69  (via drill 0.35)
  Top 0.152: v33.5,162 35,160.5 U$1.P$1
  Bottom 0.152: v33.5,162 32.5,162 27,167.5 RJ45_2X4_MODULE.UP4-7
N$70  (via drill 0.35)
  Top 0.152: v35,163 37.5,160.5 U$4.P$1
  Bottom 0.152: v35,163 29,169 24,169 RJ45_2X4_MODULE.UP4-8
N$71
  Bottom 0.152: RJ45_2X4_MODULE.LP4-7 17.5,161.5 21.5,161.5 24,159 31.5,159 34.5,162 38.5,162 40,160.5 U$5.P$1
N$72
  Bottom 0.152: RJ45_2X4_MODULE.LP4-8 20,160 21.5,158.5 41,158.5 42.5,160 U$25.P$1
N$73  (via drill 0.35)
  Top 0.152: U$26.CH 9.5,122.5 7.5,124.5 7.5,143.5 20.5,156.5 20.5,157.5 22.5,159.5 v22.5,163 22.5,165 23.5,166 24,166 24,166.5 RJ45_2X4_MODULE.UP4-6
  Bottom 0.152: v22.5,163 20,163 RJ45_2X4_MODULE.LP4-6
SCL  (via drill 0.35)
  Top 0.152: ESP32-POE-ISO.16 82.5,58.5 72.5,58.5 72.5,103 66.5,109 66.5,110 U$21.P$1 | I/O_EXPANDER_6.SCL 71,124 71,173.5 I/O_EXPANDER_4.SCL | v54.5,110.5 52,113 v52,119.5
  Bottom 0.152: 53.5,121 53.5,123.5 I/O_EXPANDER.SCL | 53.5,121 67,121 69.5,123.5 70.5,123.5 I/O_EXPANDER_6.SCL | 34.5,176 35.5,175 35.5,174 I/O_EXPANDER_2.SCL | 34.5,176 25.5,185 4.93,185 3.54,183.61 I/O_EXPANDER_3.SCL | 34.5,176 51,176 53,174 I/O_EXPANDER_1.SCL 53,173.5 55.5,171 71,171 71,173.5 I/O_EXPANDER_4.SCL | v54.5,110.5 55.5,110.5 57,112 64.5,112 66,110.5 U$21.P$1 | 53.5,121 v52,119.5
SDA  (via drill 0.35)
  Top 0.152: ESP32-POE-ISO.13 82.5,50 78.08,45.58 78,45.5 77.12,44.62 67.45,44.62 65,47.06 v65,104 | I/O_EXPANDER_2.SDA 38.5,174 40.5,176 55.04,176 55.04,176.01 55.5,175.54 55.5,174 I/O_EXPANDER_1.SDA | I/O_EXPANDER_4.SDA 73.5,173.5 73.5,124 I/O_EXPANDER_6.SDA | v54.5,109.5 51.5,112.5 51.5,118 50,119.5 v50,125.5
  Bottom 0.152: v65,104 59,110 U$24.P$1 58.5,110 58,109.5 v54.5,109.5 | I/O_EXPANDER_1.SDA 56,174 56,176 71,176 73,174 I/O_EXPANDER_4.SDA | 58,126 56,124 I/O_EXPANDER.SDA | 58,126 72,126 73,125 73,124 I/O_EXPANDER_6.SDA | 58,126 50,126 | 50,126 48.5,126 39.5,135 7.5,135 7.5,142.5 4,146 I/O_EXPANDER_3.SDA | 50,126 v50,125.5

### Text on the board
tPlace: UP4-7 | UP4-8 | LP4-7 | LP4-8 | 5V | 3.3V | GND | EN | 0 | 1 | 2 | 3 | 4 | 5 | 13 | 14 | 15 | 16 | 32 | 33 | 34 | 35 | 36 | 39 | V2.0
bPlace: iModDom@ipleiria.pt
tNames: RELAY | 1 | 2 | 1 | 4 | I/O EXPANDER | I/O EXPANDER | I/O EXPANDER | 5 | 6 | I/O EXPANDER | I/O EXPANDER | I/O EXPANDER | 3 | iModDom | RELAY | 2 | RELAY | 3
bNames: LP4 CANbus | UP4 CANbus | 6 CH | 5 CL | 6 CH | 5 CL | 8 LP4-8 | 7 LP4-7 | 8 UP4-8 | 7 UP4-7 | All Ports: Pins 1,2 - GND Pin 3 - 3.3V Pin 4 - 5V | LP1 | UP1 | 8 7 | 7 6 | 6 5 | 5 4 | LP3 I/O3 | 8 3 | 7 2 | 6 1 | 5 0 | UP3 I/O3 | LP2 | UP2 | 8 7 | 7 6 | 6 5 | 5 4 | LP2 I/O2 | 8 3 | 7 2 | 6 1 | 5 0 | UP2 I/O2 | LP3 | UP3 | 8 7 | 7 6 | 6 5 | 5 4 | LP1 I/O1 | 8 3 | 7 2 | 6 1 | 5 0 | UP1 I/O1 | LP4 | UP4